# EAGLE design led (EAGLE 7.4.0)
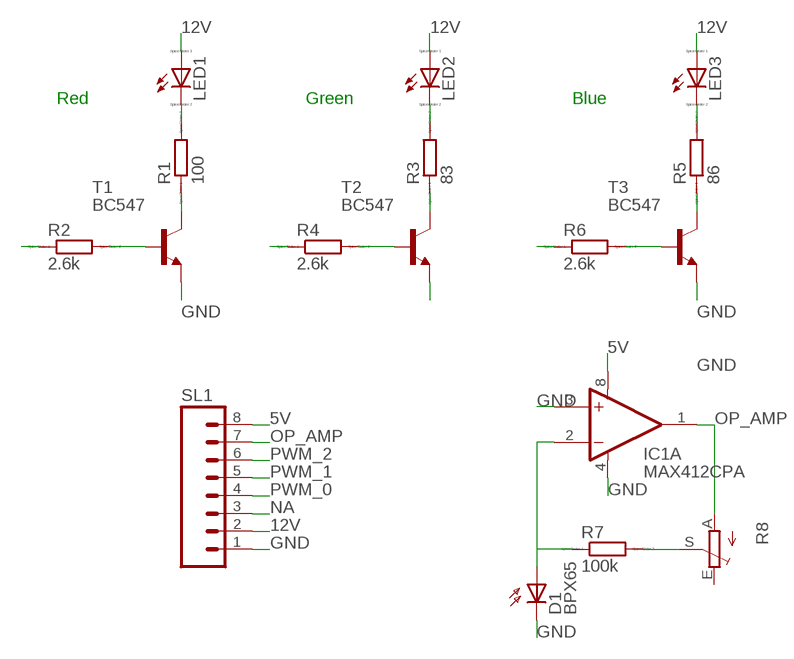
[diagram p0: schematic, sheet 1]

## Parts
D1  BPX65  [BPX65]
IC1  MAX412CPA  [DIL08]
LED1  LED_ELD260  [LED_LD260]
LED2  LED_ELD260  [LED_LD260]
LED3  LED_ELD260  [LED_LD260]
R1  100  R0204/7  [0204/7]
R2  2.6k  R0204/7  [0204/7]
R3  83  R0204/7  [0204/7]
R4  2.6k  R0204/7  [0204/7]
R5  86  R0204/7  [0204/7]
R6  2.6k  R0204/7  [0204/7]
R7  100k  R0204/7  [0204/7]
R8  TRIM_EU-B90P  [SP19L]
SL1  M08  [08P]
T1  BC547  [TO92]
T2  BC547  [TO92]
T3  BC547  [TO92]

## Nets
5V: IC1.8(A:V+) SL1.8
12V: LED1.A LED2.A LED3.A SL1.2
GND: D1.K(C) IC1.3(A:+IN) IC1.4(A:V-) SL1.1 T1.1(E) T2.1(E) T3.1(E)
N$1: R4.2 T2.2(B)
N$2: LED1.K(C) R1.2
N$3: R2.2 T1.2(B)
N$4: R1.1 T1.3(C)
N$5: LED2.K(C) R3.2
N$6: R3.1 T2.3(C)
N$7: R6.2 T3.2(B)
N$8: LED3.K(C) R5.2
N$9: R5.1 T3.3(C)
N$10: D1.A IC1.2(A:-IN) R7.1
N$12: R7.2 R8.S
NA: SL1.3
OP_AMP: IC1.1(A:OUT) R8.A SL1.7
PWM_0: R2.1 SL1.4
PWM_1: R4.1 SL1.5
PWM_2: R6.1 SL1.6
Unconnected: IC1.5(B:+IN) IC1.6(B:-IN) IC1.7(B:OUT) R8.E

## Notes on the sheet
- Red | Green | Blue

## Library data of the parts
D1 = opto-trans-siemens:BPX65: PHOTO DIODE; MPN: BPX65.; OC_FARNELL: 327451; OC_NEWARK: 06WX2764
IC1 = maxim:MAX412CPA: OP AMP; MPN: MAX412CPA; OC_FARNELL: unknown; OC_NEWARK: 99K3347
LED1-LED3 = eagle-ltspice:LED_E: LED Source: http://www.osram.convergy.de Source: www.luxeon.com Source: www.kingbright.com; SPICEMODEL: NONE; SPICEPREFIX: D; SPICETYPE: diode
R1-R7 = eagle-ltspice:R: RESISTOR, European symbol; SPICEMODEL: NONE; SPICEPREFIX: R
R8 = pot:TRIM_EU-: POTENTIOMETER
SL1 = con-amp-quick:M08: AMP QUICK CONNECTOR; OC_FARNELL: unknown; OC_NEWARK: unknown
T1-T3 = transistor:BC547: NPN TRANSISTOR

## Board
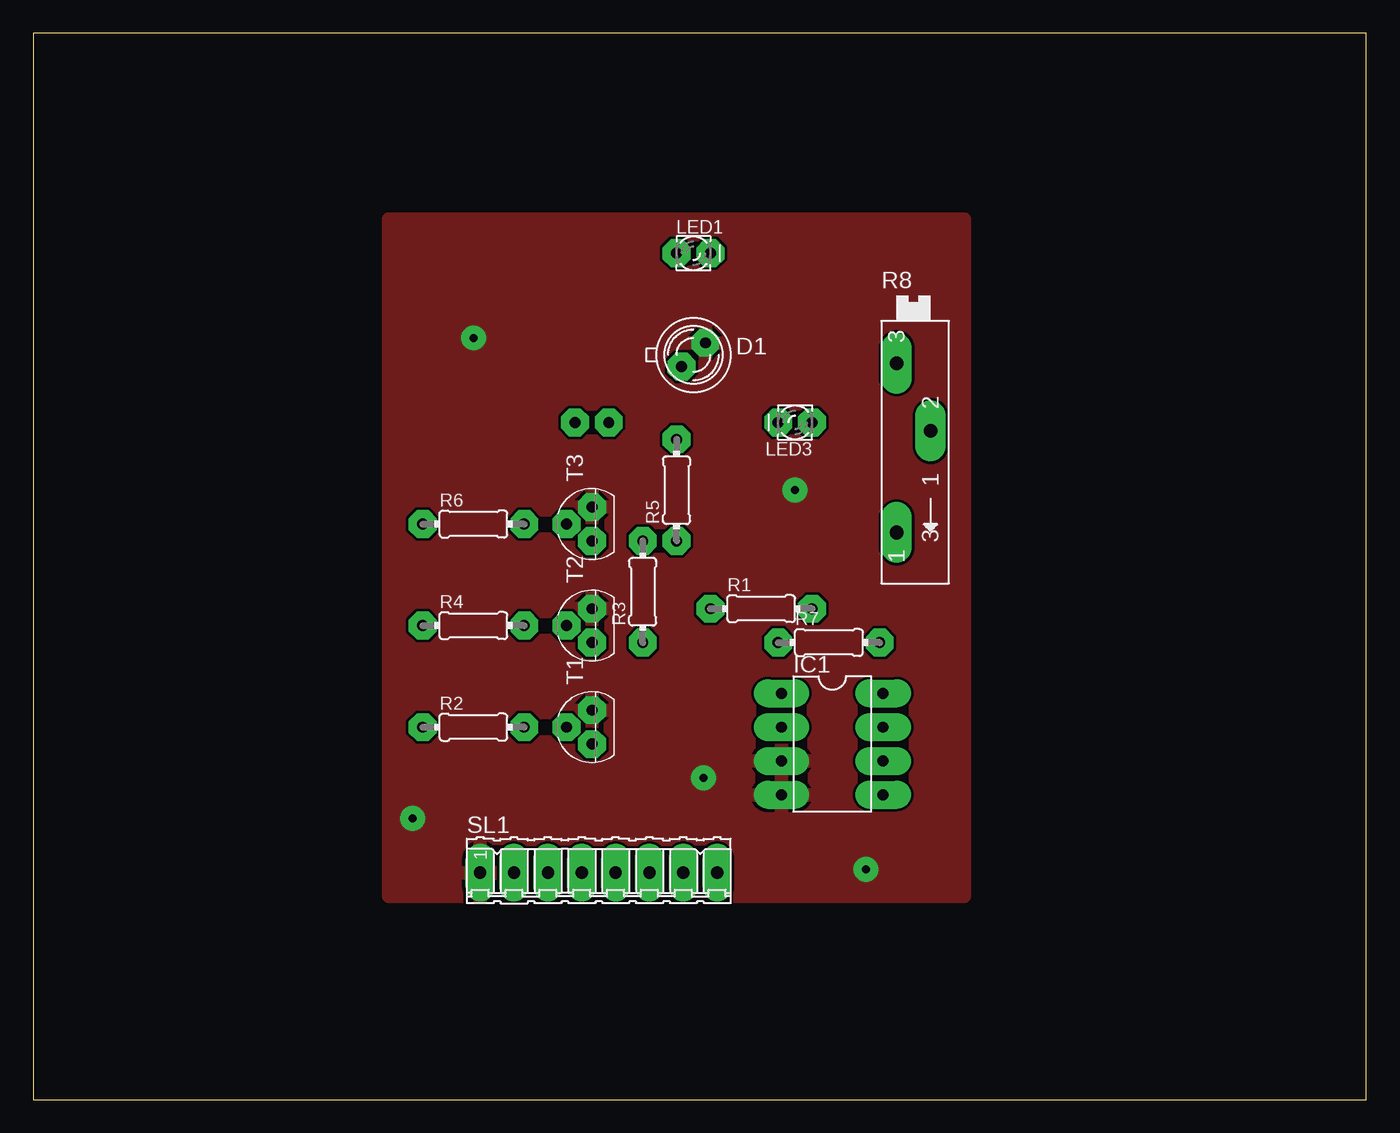
[diagram p1: board, top side]
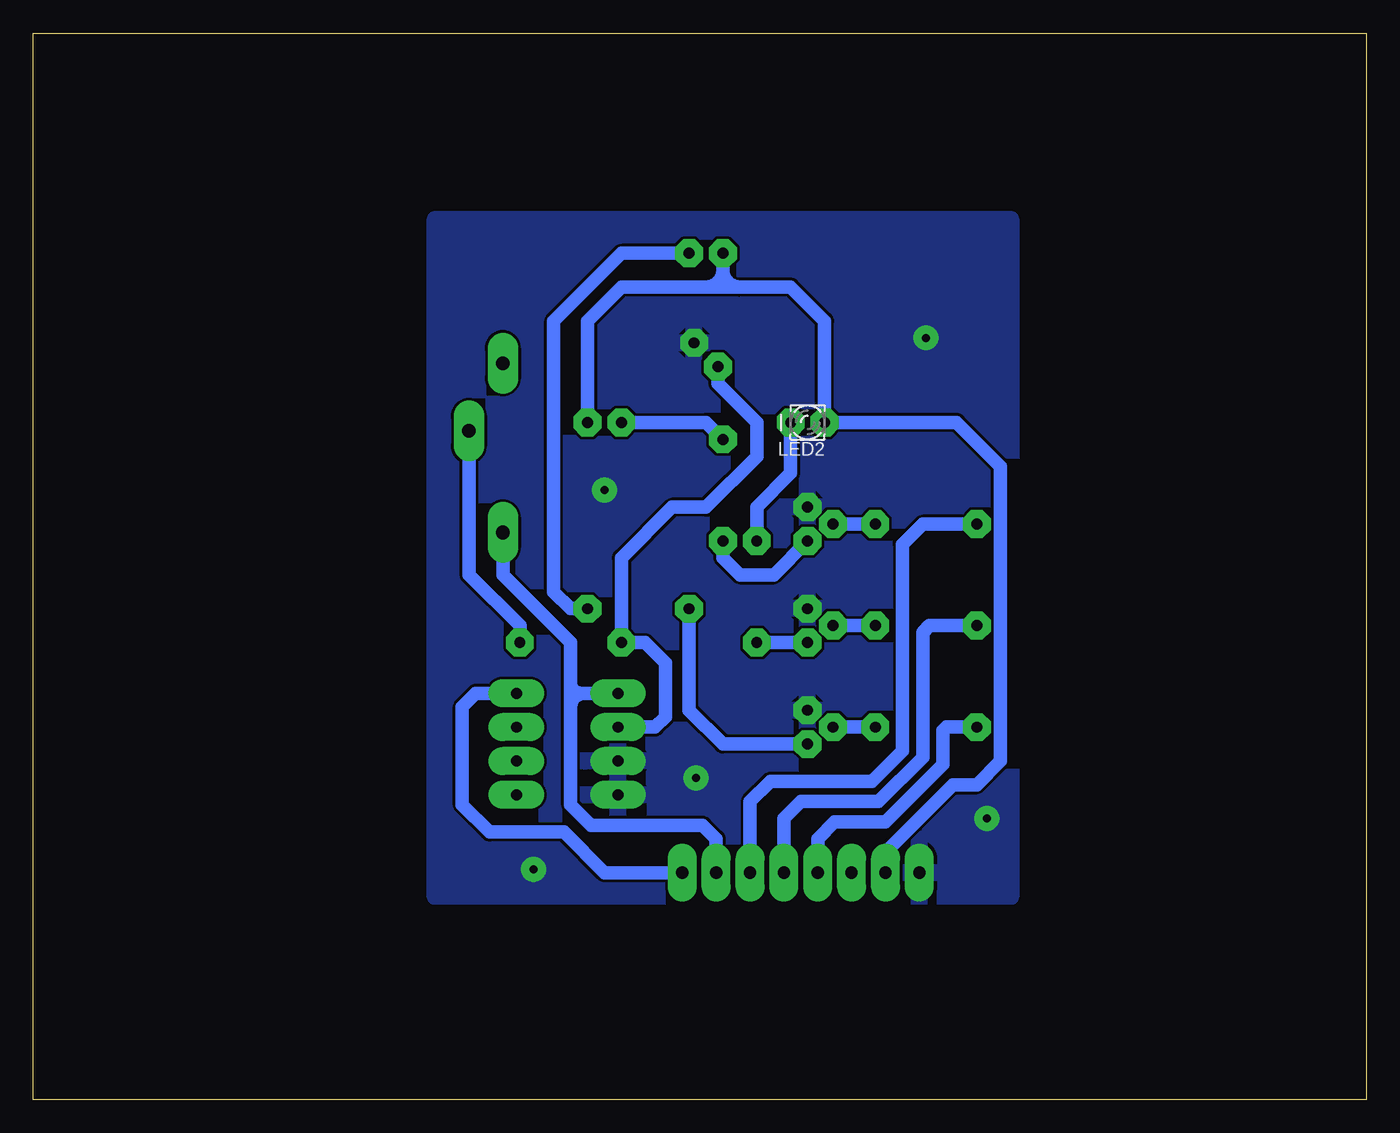
[diagram p2: board, bottom side, seen from below]

Size 100 x 80 mm. Coordinates in mm from the lower left corner, seen from the top.
Outline: 0,0 100,0 100,80 0,80 0,0
Copper layers (1*16): Top 0.035mm / dielectric 1.5mm / Bottom 0.035mm
Design rules "default *": minimum track width 10mil, minimum drill 24mil, track to track 8mil, track to pad 8mil, pad to pad 8mil, via to via 8mil, smd to smd 8mil, copper to edge 40mil, drill to drill 8mil, minimum pad ring 25mil, minimum via ring 25mil, stop-mask expansion 4mil, vias tented up to drill 0mil, thermal gap 10mil

### Footprints (pad centres in the part's own frame; a part is rotated, then mirrored left to right if it is on the bottom)
BPX65 = drill 0.813 octagon: A -0.889,-0.889; K 0.889,0.889
DIL08 = drill 0.813 long: 1 -3.81,-3.81; 2 -1.27,-3.81; 3 1.27,-3.81; 4 3.81,-3.81; 5 3.81,3.81; 6 1.27,3.81; 7 -1.27,3.81; 8 -3.81,3.81
LED_LD260 = drill 0.813 octagon: A -1.27,0; K 1.27,0
0204/7 = drill 0.813 octagon: 1 -3.81,0; 2 3.81,0
SP19L = drill 1.016 long: A 5.715,-1.27; E -6.985,-1.27; S -1.905,1.27
08P = drill 0.914 long: 1 -8.89,0; 2 -6.35,0; 3 -3.81,0; 4 -1.27,0; 5 1.27,0; 6 3.81,0; 7 6.35,0; 8 8.89,0
TO92 = drill 0.813 octagon: 1 1.27,0; 2 0,1.905; 3 -1.27,0

### Placement (x,y rotation side)
D1  49.53,55.88 0 top
IC1  59.94,26.67 270 top
LED1  49.53,63.5 0 top
LED2  41.91,50.8 180 bottom
LED3  57.15,50.8 180 top
R1  54.61,36.83 0 top
R2  33.02,27.94 0 top
R3  45.72,38.1 90 top
R4  33.02,35.56 0 top
R5  48.26,45.72 90 top
R6  33.02,43.18 0 top
R7  59.69,34.29 0 top
R8  66.04,48.26 270 top
SL1  42.42,17.02 0 top
T1  41.91,27.94 90 top
T2  41.91,35.56 90 top
T3  41.91,43.18 90 top

### Tracks (layer width: path | path; a pad name or v marks a point on that pad's centre or on a via)
5V
  Bottom 1.016: SL1.8 57.15,17.02 60.2,20.07 65.79,20.07 67.82,22.1 67.82,29.46 66.8,30.48 IC1.8
12V
  Bottom 1.016: 46.99,60.96 43.18,60.96 40.64,58.42 LED2.A 30.73,50.8 27.43,47.5 27.43,25.4 29.21,23.62 30.99,23.62 36.07,18.54 SL1.2 | 46.99,60.96 48.26,60.96 | 48.26,60.96 49.53,60.96 | 49.53,60.96 55.88,60.96 58.42,58.42 LED3.A | LED1.A 48.26,62.23 | 48.26,62.23 48.26,60.96 | 48.26,62.23 arc90 49.53,60.96 | 48.26,62.23 arc-90 46.99,60.96
GND  (via drill 0.6, 0.6 pad 1.78)
  other vias: 33.02,57.15 62.48,17.27 57.15,45.72 28.45,21.08 50.29,24.13
  pour Top: 26.67,15.24 69.85,15.24 69.85,66.04 26.67,66.04
  pour Bottom: 26.67,15.24 69.85,15.24 69.85,66.04 26.67,66.04
N$1
  Bottom 1.016: T2.2 R4.2
N$2
  Bottom 1.016: LED1.K 55.88,63.5 60.96,58.42 60.96,38.1 59.69,36.83 R1.2
N$3
  Bottom 1.016: R2.2 T1.2
N$4
  Bottom 1.016: T1.3 48.26,26.67 50.8,29.21 R1.1
N$5
  Bottom 1.016: LED2.K 43.18,46.99 45.72,44.45 R3.2
N$6
  Bottom 1.016: R3.1 T2.3
N$7
  Bottom 1.016: T3.2 R6.2
N$8
  Bottom 1.016: LED3.K 49.53,50.8 R5.2
N$9
  Bottom 1.016: R5.1 48.26,40.64 46.99,39.37 44.45,39.37 T3.3
N$10
  Bottom 1.016: D1.A 48.64,53.72 45.72,50.8 45.72,48.26 49.53,44.45 52.07,44.45 55.88,40.64 R7.1 54.1,34.29 52.58,32.77 52.58,28.7 53.34,27.94 IC1.2
N$12
  Bottom 1.016: R7.2 63.5,35.56 67.31,39.37 R8.S
OP_AMP
  Bottom 1.016: SL1.7 48.77,19.56 49.78,20.57 58.17,20.57 59.69,22.1 59.69,29.46 | 59.69,29.46 59.69,30.48 | 59.69,30.48 59.69,31.24 | 59.69,30.48 58.93,30.48 | 58.93,30.48 58.67,30.48 | 58.67,30.48 IC1.1 | R8.A 64.77,39.37 59.69,34.29 59.69,31.75 59.69,31.24 | 58.67,30.48 arc-90 59.69,29.46 | 58.93,30.48 arc90 59.69,31.24
PWM_0
  Bottom 1.016: R2.1 31.5,27.94 31.75,27.69 31.75,25.15 36.07,20.83 39.88,20.83 41.15,19.56 SL1.4
PWM_1
  Bottom 1.016: R4.1 32.77,35.56 33.27,35.05 33.27,25.65 36.58,22.35 42.42,22.35 43.69,21.08 SL1.5
PWM_2
  Bottom 1.016: R6.1 33.27,43.18 34.8,41.66 34.8,26.16 37.08,23.88 44.7,23.88 46.23,22.35 SL1.6